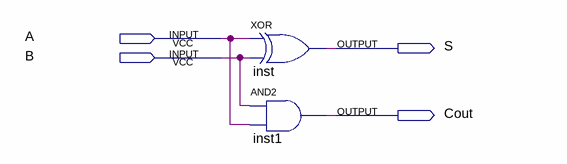
[diagram p0: schematic sheet]
// Quartus schematic MeioSomador.bdf as structural Verilog: 2 symbols, 4 pins
module MeioSomador (
  input  A,
  input  B,
  output S,
  output Cout
);

  xor inst (S, A, B);
  and inst1 (Cout, B, A);
endmodule
